# Altium schematic sheet BluePill.SchDoc
size 420 x 297 mm; SheetNumber: 2; SheetTotal: 2
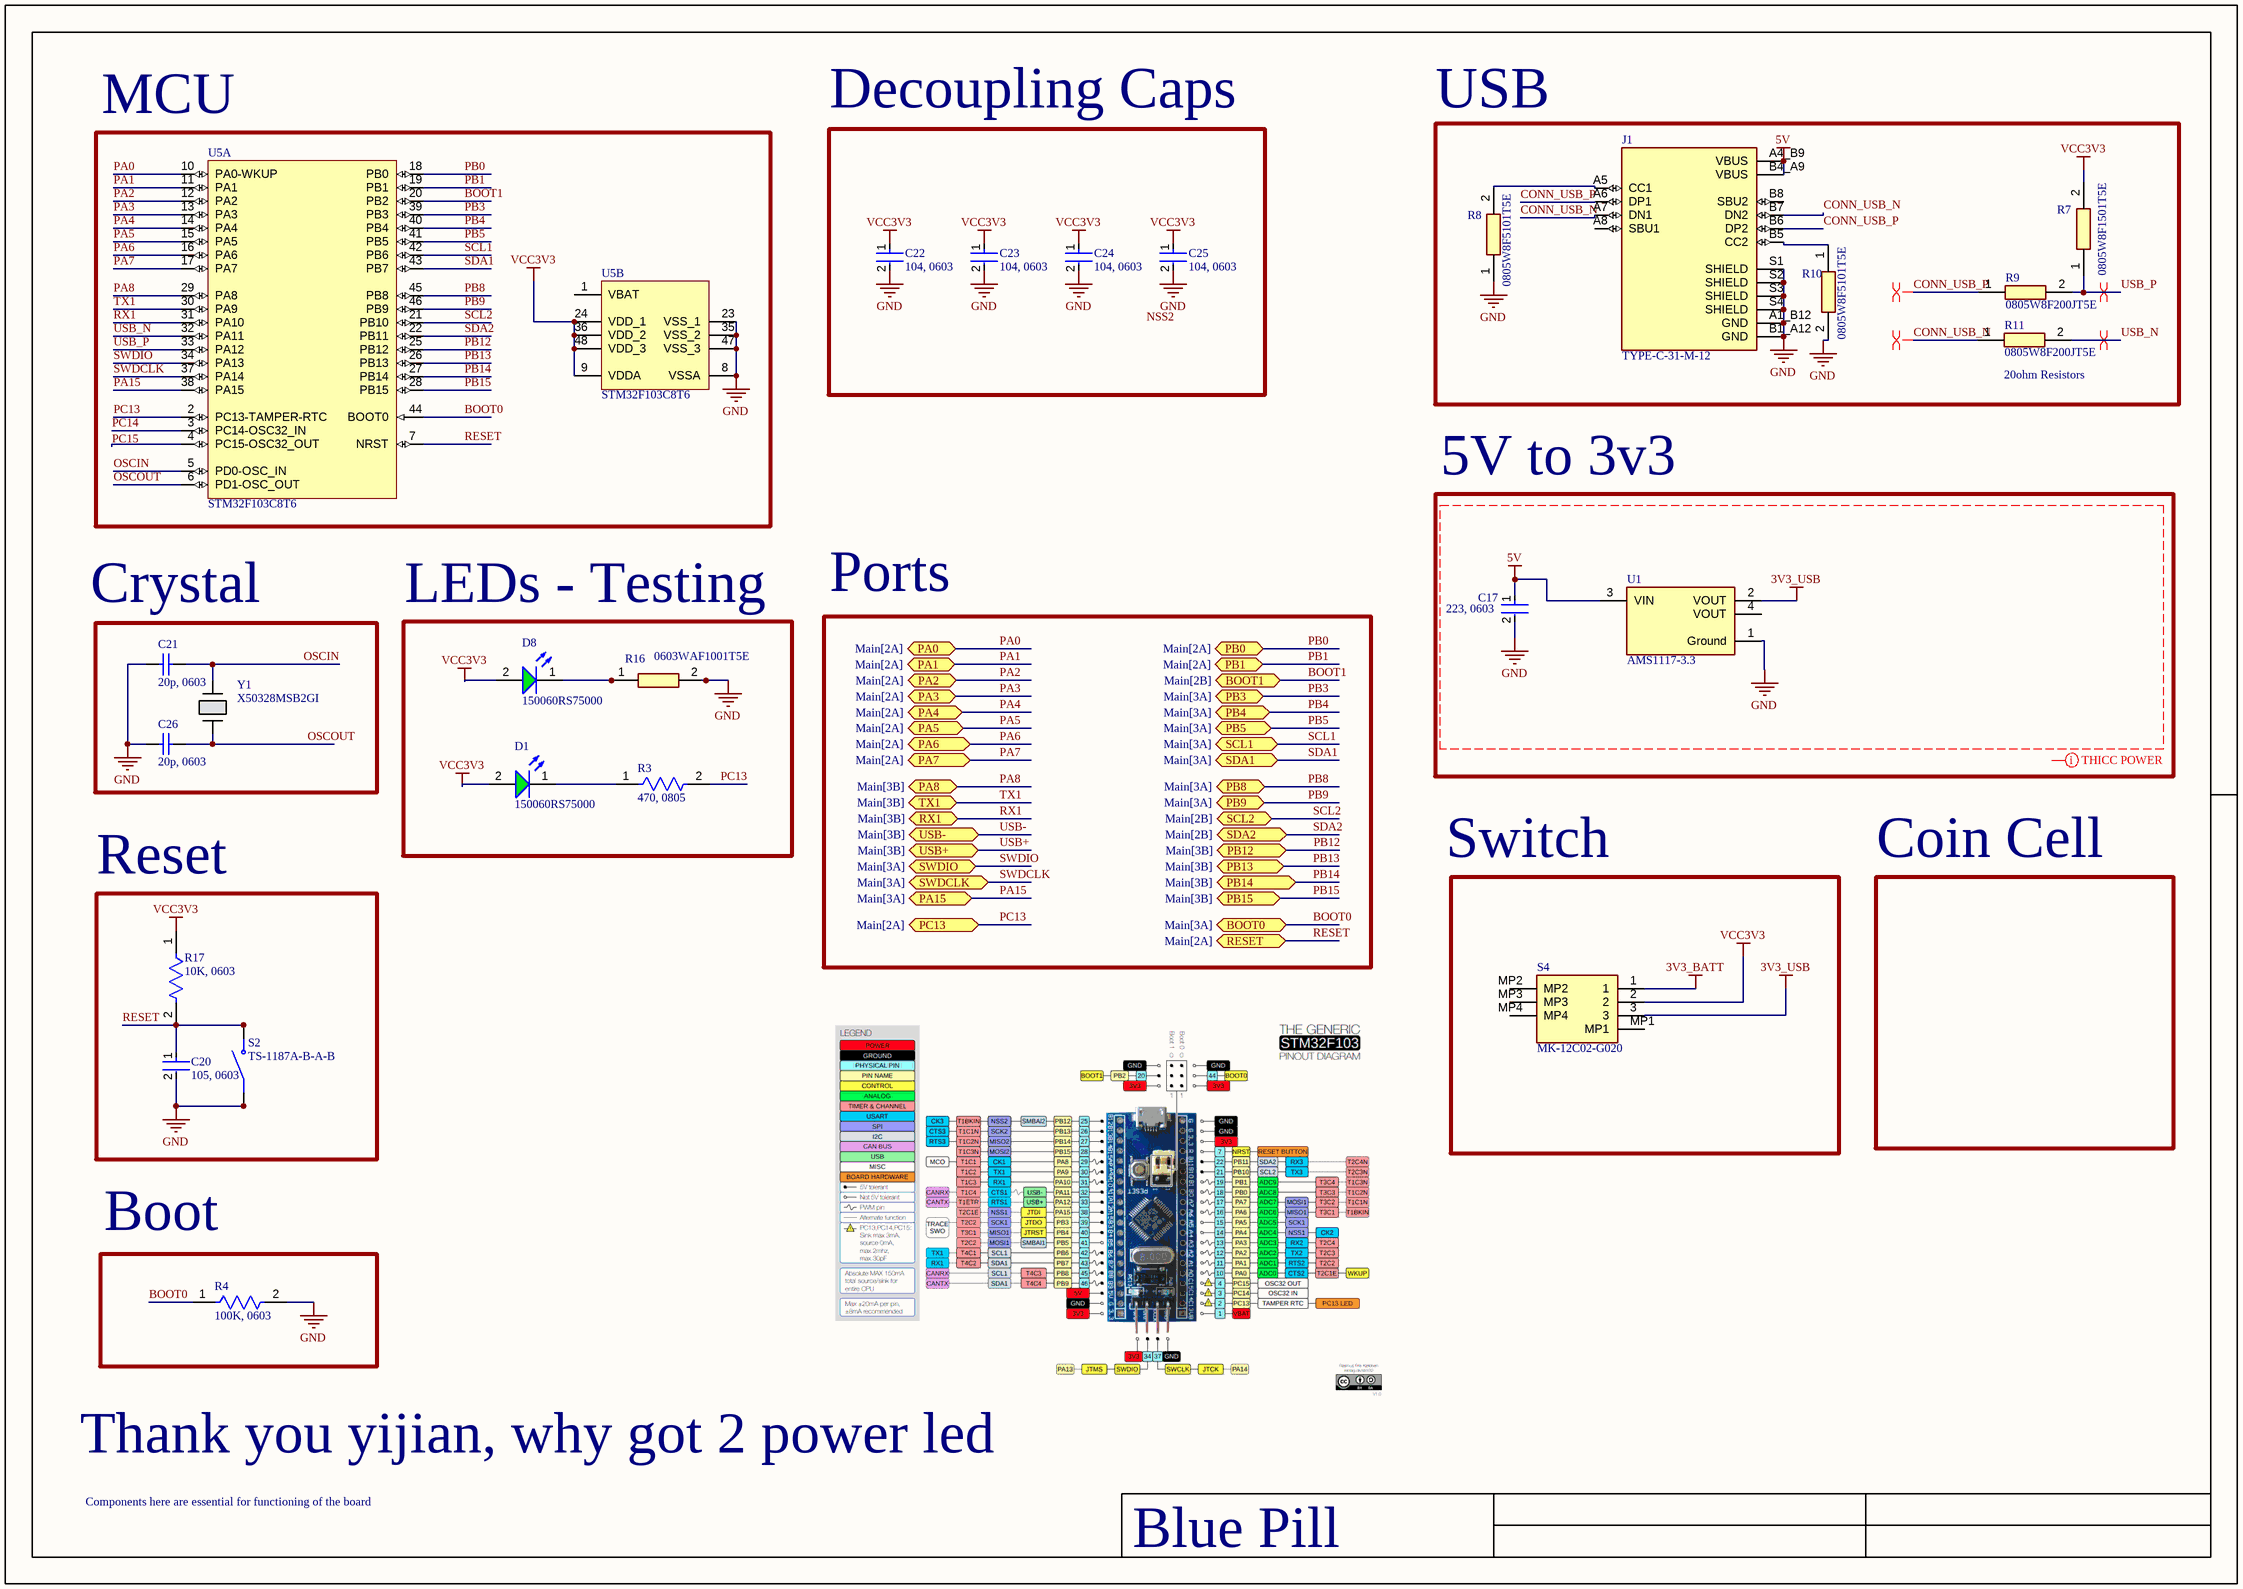
[diagram p0: BluePill.SchDoc]

## Parts
C17  223, 0603  [FP-CC0603-DA-MFG]
C20  105, 0603  [FP-CC0603-DA-MFG]
C21  20p, 0603  [CAPC1608X90X30LL10T20]
C22  104, 0603  [FP-CC0603-DA-MFG]
C23  104, 0603  [FP-CC0603-DA-MFG]
C24  104, 0603  [FP-CC0603-DA-MFG]
C25  104, 0603  [FP-CC0603-DA-MFG]
C26  20p, 0603  [CAPC1608X90X30LL10T20]
D1  150060RS75000  [WL-SMCW_0805_150080xx75000]
D8  150060RS75000  [WL-SMCW_0805_150080xx75000]
J1  TYPE-C-31-M-12  [HRO_TYPE-C-31-M-12]
R3  470, 0805  [FP-RT0805-MFG]
R4  100K, 0603  [FP-RT0603-MFG]
R7  0805W8F1501T5E  [RESC2013X65N]
R8  0805W8F5101T5E  [RESC2013X65N]
R9  0805W8F200JT5E  [RESC2013X65N]
R10  0805W8F5101T5E  [RESC2013X65N]
R11  0805W8F200JT5E  [RESC2013X65N]
R16  0603WAF1001T5E  [RESC1608X55N]
R17  10K, 0603  [FP-RC0603-0_55-IPC_C]
S2  TS-1187A-B-A-B  [SW_TS-1187A-B-A-B]
S4  MK-12C02-G020  [MK12C02G020]
U1  AMS1117-3.3  [FP-AMS1117-IPC_B]
U5  STM32F103C8T6  [STM-LQFP48_L]  (parts A,B of 2)
Y1  X50328MSB2GI  [XTAL_MSB2GI_YXC]

## Blocks framed on the sheet
MCU: U5
Decoupling Caps: C22-C25
USB: J1 R7-R11
5V to 3v3: C17 U1
LEDs - Testing: D1 D8 R3 R16
Reset: C20 R17 S2
Boot: R4

## Ports
BOOT0 (bidir, see Main[3A]), BOOT1 (bidir, see Main[2B]), PA0 (bidir, see Main[2A]), PA1 (bidir, see Main[2A]), PA2 (bidir, see Main[2A]), PA3 (bidir, see Main[2A]), PA4 (bidir, see Main[2A]), PA5 (bidir, see Main[2A]), PA6 (bidir, see Main[2A]), PA7 (bidir, see Main[2A]), PA8 (bidir, see Main[3B]), PA15 (bidir, see Main[3A]), PB0 (bidir, see Main[2A]), PB1 (bidir, see Main[2A]), PB3 (bidir, see Main[3A]), PB4 (bidir, see Main[3A]), PB5 (bidir, see Main[3A]), PB8 (bidir, see Main[3A]), PB9 (bidir, see Main[3A]), PB12 (bidir, see Main[3B]), PB13 (bidir, see Main[3B]), PB14 (bidir, see Main[3B]), PB15 (bidir, see Main[3B]), PC13 (bidir, see Main[2A]), RESET (bidir, see Main[2A]), RX1 (bidir, see Main[3B]), SCL1 (bidir, see Main[3A]), SCL2 (bidir, see Main[2B]), SDA1 (bidir, see Main[3A]), SDA2 (bidir, see Main[2B]), SWDCLK (bidir, see Main[3A]), SWDIO (bidir, see Main[3A]), TX1 (bidir, see Main[3B]), USB+ (bidir, see Main[3B]), USB- (bidir, see Main[3B])

## Nets
3V3_BATT: S4.1
3V3_USB: S4.3 U1.2(VOUT)
5V: C17.1 J1.A4_B9(VBUS) J1.B4_A9(VBUS) U1.3(VIN)
GND: C17.2 C20.2 C21.1 C22.2 C23.2 C24.2 C25.2 C26.1 J1.A1_B12(GND) J1.B1_A12(GND) J1.S1(SHIELD) J1.S2(SHIELD) J1.S3(SHIELD) J1.S4(SHIELD) R4.2 R8.1 R10.2 R16.2 S2.A(COM) S2.B(COM) U1.1(Ground) U5.8(VSSA) U5.23(VSS_1) U5.35(VSS_2) U5.47(VSS_3)
VCC3V3: C22.1 C23.1 C24.1 C25.1 D1.2(A) D8.2(A) R7.2 R17.1 S4.2 U5.9(VDDA) U5.24(VDD_1) U5.36(VDD_2) U5.48(VDD_3)
BOOT0: R4.1 U5.44(BOOT0) ; port BOOT0
BOOT1: U5.20(PB2) ; port BOOT1
CONN_USB_N: J1.A7(DN1) J1.B7(DN2) R11.1
CONN_USB_P: J1.A6(DP1) J1.B6(DP2) R9.1
OSCIN: C21.2 U5.5(PD0-OSC_IN) Y1.1
OSCOUT: C26.2 U5.6(PD1-OSC_OUT) Y1.2
PA0: U5.10(PA0-WKUP) ; port PA0
PA1: U5.11(PA1) ; port PA1
PA2: U5.12(PA2) ; port PA2
PA3: U5.13(PA3) ; port PA3
PA4: U5.14(PA4) ; port PA4
PA5: U5.15(PA5) ; port PA5
PA6: U5.16(PA6) ; port PA6
PA7: U5.17(PA7) ; port PA7
PA8: U5.29(PA8) ; port PA8
PA15: U5.38(PA15) ; port PA15
PB0: U5.18(PB0) ; port PB0
PB1: U5.19(PB1) ; port PB1
PB3: U5.39(PB3) ; port PB3
PB4: U5.40(PB4) ; port PB4
PB5: U5.41(PB5) ; port PB5
PB8: U5.45(PB8) ; port PB8
PB9: U5.46(PB9) ; port PB9
PB12: U5.25(PB12) ; port PB12
PB13: U5.26(PB13) ; port PB13
PB14: U5.27(PB14) ; port PB14
PB15: U5.28(PB15) ; port PB15
PC13: R3.2 U5.2(PC13-TAMPER-RTC) ; port PC13
PC14: U5.3(PC14-OSC32_IN)
PC15: U5.4(PC15-OSC32_OUT)
RESET: C20.1 R17.2 S2.C(NO) S2.D(NO) U5.7(NRST) ; port RESET
RX1: U5.31(PA10) ; port RX1
SCL1: U5.42(PB6) ; port SCL1
SCL2: U5.21(PB10) ; port SCL2
SDA1: U5.43(PB7) ; port SDA1
SDA2: U5.22(PB11) ; port SDA2
SWDCLK: U5.37(PA14) ; port SWDCLK
SWDIO: U5.34(PA13) ; port SWDIO
TX1: U5.30(PA9) ; port TX1
USB+: port USB+
USB-: port USB-
USB_N: R11.2 U5.32(PA11)
USB_P: R7.1 R9.2 U5.33(PA12)
NetD1_1: D1.1(K) R3.1
NetD8_1: D8.1(K) R16.1
NetJ1_A5: J1.A5(CC1) R8.2
NetJ1_B5: J1.B5(CC2) R10.1

Not connected (* = marked no-connect by the designer): J1 A8(SBU1) B8(SBU2); S4 MP1 MP2 MP3 MP4; U1 4(VOUT); U5 1(VBAT)

## Layout directives
CompClassName: THICC POWER CLASS: (no net found under the mark)
differential pair: CONN_USB_N, CONN_USB_P, USB_N, USB_P

## Notes on the sheet
- (near R11) 20ohm Resistors
- Crystal
- Ports
- Switch
- Coin Cell
- Thank you yijian, why got 2 power led
- Components here are essential for functioning of the board
- Blue Pill
- Labels drawn without touching a wire or pin: NSS2

## Library data of the parts
C17 = CMP-2100-03602-3: CAP CER 0.022UF 50V X7R 0603; Dielectric Material: Ceramic; Insulation Resistance: 100GR; Tolerance: 10%; Capacitance: 22nF; Thickness: 0.035inch; Case/Package: 0603; Packaging: Tape and Reel; Voltage Rating (DC): 50V; Length: 1.6mm; Depth: 0.8mm; Dielectric: X7R; Resistor Type: Ceramic; Min Operating Temperature: -55°C; Number of Pins: 2; Series: CC; Mount: Surface Mount; Max Operating Temperature: 125°C; Case Code (Imperial): 0603; Width: 0.031inch; Halogen Free: Halogen Free; Lead Free: Lead Free; Voltage: 50V; RoHS Compliant: Yes; Package Quantity: 1; Height: 0.8mm; REACH SVHC: No SVHC; Voltage Rating: 50V; Case Code (Metric): 1608; Termination: SMD/SMT; Radiation Hardening: No
C20 = CMP-1035-02737-2: CAP CER 1UF 16V X5R 0603; Manufacturer Part Number: CC0603KRX5R7BB105; Manufacturer: YAGEO; Material: Ceramic; Temperature Coefficient: 15%; Tolerance: 0.1; Digikey Description: CAP CER 1UF 16V X5R 0603; Category: Cap; Automotive: No; Octopart: https://octopart.com/cc0603krx5r7bb105-yageo-8376530; Voltage Rating: 16 V; Device Class L3: Ceramic Capacitors; Value: 1 uF; Temperature Characteristic: X5R; Voltage: 16 V; RoHS: TRUE; Lead Free: Yes; Temperature: -55°C to +125°C; Device Class L2: Capacitors; ComponentLink2URL: http://www.yageo.com/documents/recent/UPY-GPHC_X7R_6.3V-to-50V_18.pdf; Capacitance: 1 uF; Footprint Url: http://www.yageo.com/exep/pages/download/literatures/UPY-C_GEN_24.pdf; Height: 0.9mm; ComponentLink2Description: Datasheet; Temperature Range High: +125°C; Mouser Description: Multilayer Ceramic Capacitors MLCC - SMD/SMT 1.0uF 16V X5R 10%; Package: CC0603-DA; Device Class L1: Passive Components; Temperature Range Low: -55°C
C21 C26 = CMP-2000-06100-1: Chip Capacitor, 20 pF, +/- 5%, 50 V, -55 to 85 degC, 0603 (1608 Metric), RoHS, Tape and Reel; Manufacturer: Samsung Electro-Mechanics; Dielectric: C0G; Rated Voltage: 50V; Capacitance: 20pF; Tolerance (%): ±5%; Case Size/Dimension: 0603; Datasheet Version: 06/2016; Manufacturer URL: http://www.samsungsem.com/global/index.jsp; Datasheet URL: http://www.samsungsem.com/kr/support/product-search/mlcc/__icsFiles/afieldfile/2016/08/18/S_CL10C200JB8NNNC.pdf; Mounting Technology: SurfaceMount; Package Description: 2-Pin Surface Mount Device, Body 1.60 x 0.80 mm; Package Reference: 0603
C22-C25 = CMP-2000-05002-2: CAP CER 0.1UF 16V X7R 0603; Manufacturer Part Number: CC0603KRX7R7BB104; Manufacturer: YAGEO; Tolerance: 0.1; Value: 100 nF; Temperature Coefficient: 15%; Material: Ceramic; Voltage Rating: 16 V; Package: CC0603-DA; ComponentLink2Description: Datasheet; Octopart: https://octopart.com/cc0603krx7r7bb104-yageo-192941; Temperature Range High: +125°C; Digikey Description: CAP CER 0.1UF 16V X7R 0603; Voltage: 16 V; Device Class L2: Capacitors; Height: 0.9mm; Temperature: -55°C to +125°C; Device Class L1: Passive Components; Device Class L3: Ceramic Capacitors; ComponentLink2URL: http://www.yageo.com/documents/recent/UPY-GPHC_X7R_6.3V-to-50V_18.pdf; Footprint Url: http://www.yageo.com/exep/pages/download/literatures/UPY-C_GEN_24.pdf; RoHS: TRUE; Temperature Range Low: -55°C; Temperature Characteristic: X7R; Lead Free: Yes; Capacitance: 100 nF; Category: Cap; Mouser Description: Multilayer Ceramic Capacitor, CC Series, 0.1 - F, - 10%, X7R, 16 V, 0603 [1608 Metric]; Automotive: No
D1 D8 = CMP-1426-00007-2: NexarPartId: 29717780; Wavelength: 520nm; Forward Current: 100mA; Lens Style: Clear, Rectangular; Dominant Wavelength: 525nm; Max Junction Temperature (Tj): 95°C; Power Dissipation: 105mW; Luminous Intensity: 450mcd; Peak Wavelength: 515nm; Color: Green; Viewing Angle: 140°; Test Current: 20mA; Reverse Voltage: 5V; Forward Voltage: 3.2V; Mount: Surface Mount; REACH SVHC: Unknown; Min Operating Temperature: -40°C; Case Code (Imperial): 0805; Case/Package: 0805; Max Operating Temperature: 85°C; RoHS: Compliant; Length: 2mm; Height: 700µm; Width: 1.25mm; Case Code (Metric): 2012; Packaging: Tape and Reel; Max Reverse Voltage (DC): 5V
J1 = CMP-002-00071-1: USB Connectors 24 Receptacle 1 8.94*7.3mm RoHS; MF: HRO Electronics Co., Ltd.; Value: *; Price: None; Component Type: Standard; Check_prices: https://www.snapeda.com/parts/TYPE-C-31-M-12/HRO+Electronics+Co.%252C+Ltd./view-part/?ref=eda; MP: TYPE-C-31-M-12; Case/Package: Package; Availability: Not in stock; Design Item ID: TYPE-C-31-M-12; Source: TYPE-C-31-M-12.SchLib; SnapEDA_Link: https://www.snapeda.com/parts/TYPE-C-31-M-12/HRO+Electronics+Co.%252C+Ltd./view-part/?ref=snap; Pins: 16
R3 = CMP-03412-031818-1: RES SMD 470 OHM 1% 1/8W 0805; Manufacturer Part Number: RT0805FRE07470RL; Manufacturer: Yageo; Temperature Coefficient: 50 ppm/°C; Value: 470Ω; Tolerance: 0.0001; Voltage Rating: 150V; Power Rating: 0.125W; Automotive: No; Device Class L2: Resistors; Lead Free: Yes; Digikey Description: RES SMD 470 OHM 1% 1/8W 0805; Category: Res; Package: RT0805; ComponentLink2Description: Datasheet; Ipc Land Pattern Name: RESC200125X50; Resistance: 470Ω; Octopart: https://octopart.com/rt0805fre07470rl-yageo-39983328; Height: 0.6mm; Temperature Range High: +155°C; Composition: Thin Film; Footprint Url: http://www.yageo.com/exep/pages/download/literatures/PYu-R_Mount_10.pdf; Device Class L1: Passive Components; Temperature Range Low: -55°C; Temperature: -55°C to +155°C; RoHS: TRUE; ComponentLink2URL: http://www.yageo.com/documents/recent/PYu-RT_1-to-0.01_RoHS_L_9.pdf; Mouser Description: High Precision-High Stability Chip Resistor Thin Film 0805 470Ohm 1% Paper T/R; Device Class L3: Chip SMD Resistors; Series: RT
R4 = CMP-03412-015060-1: RES SMD 100K OHM 1% 1/10W 0603; Manufacturer: Yageo; Manufacturer Part Number: RT0603FRE07100KL; Tolerance: 0.01; Resistance: 100KΩ; Temperature Coefficient: 50 ppm/°C; Value: 100KΩ; Power Rating: 0.1W; Voltage Rating: 75V; Temperature: -55°C to +155°C; Height: 0.55mm; Octopart: https://octopart.com/rt0603fre07100kl-yageo-41455806; Ipc Land Pattern Name: RESC16080X45; Lead Free: Yes; Device Class L1: Passive Components; Temperature Range Low: -55°C; Temperature Range High: +155°C; Category: Res; Composition: Thin Film; Device Class L3: Chip SMD Resistors; Digikey Description: RES SMD 100K OHM 1% 1/10W 0603; Package: RT0603; Automotive: No; Mouser Description: High Precision-High Stability Chip Resistor Thin Film 0603 100kOhm 1% Paper T/R; Footprint Url: http://www.yageo.com/exep/pages/download/literatures/PYu-R_Mount_10.pdf; ComponentLink2Description: Datasheet; Series: RT; ComponentLink2URL: http://www.yageo.com/documents/recent/PYu-RT_1-to-0.01_RoHS_L_9.pdf; Device Class L2: Resistors; RoHS: TRUE
R7 R9 R11 = 0805W8F200JT5E: Resistor; Manufacturer_Name: UNI-ROYAL(Uniroyal Elec); Height: 0.65mm
  R7: Manufacturer_Part_Number: 0805W8F1501T5E
  R9 R11: Datasheet Link: https://datasheet.lcsc.com/lcsc/2206010200_UNI-ROYAL-Uniroyal-Elec-0805W8F200JT5E_C17544.pdf; Manufacturer_Part_Number: 0805W8F200JT5E
R8 R10 = 0805W8F5101T5E: Resistor; Manufacturer_Name: UNI-ROYAL(Uniroyal Elec); Datasheet Link: https://datasheet.lcsc.com/lcsc/2206010030_UNI-ROYAL-Uniroyal-Elec-0805W8F5101T5E_C27834.pdf; Height: 0.65mm; Manufacturer_Part_Number: 0805W8F5101T5E
R16 = CMP-062-000000-1: 1k +/-1% 0.1W +/-100ppm/ 0603 Chip Resistor - Surface Mount; Manufacturer_Name: UNI-ROYAL(Uniroyal Elec); Height: 0.55mm; Manufacturer_Part_Number: 0603WAF1001T5E; Datasheet Link: https://datasheet.lcsc.com/szlcsc/Uniroyal-Elec-0603WAF1001T5E_C21190.pdf; Design Item ID: 0603WAF1001T5E; Source: SamacSys.SchLib
R17 = CMP-2100-03664-2: RES 10K OHM 1% 1/10W 0603; Voltage Rating: 75V; Voltage Rating (DC): 50V; Resistance: 10kR; Power Rating: 100mW; Temperature Coefficient: 100ppm/°C; Depth: 0.8mm; Termination: SMD/SMT; Resistor Type: Thick Film; Series: RC; Construction: Rectangular; Features: Moisture Resistant; Packaging: Tape and Reel; Min Operating Temperature: -55°C; Number of Terminations: 2; Lead Pitch: 0.3mm; RoHS Compliant: Yes; Case/Package: 0603; Resistance Tolerance: 1%; Military Standard: Not; Weight: 7.1E-05oz; Number of Pins: 2; Tolerance: 1%; Length: 1.6mm; Case Code (Imperial): 0603; Lead Free: Lead Free; Width: 0.8mm; Max Power Dissipation: 100mW; Height: 0.45mm; Max Operating Temperature: 155°C; Case Code (Metric): 1608; Size Code: 0603
S2 = CMP-033-000000-1: SPST 50mA @ 12VDC Top Actuated Round Button 160gf SMD Tactile Switches RoHS; MP: TS-1187A-B-A-B; Value: *; Design Item ID: TS-1187A-B-A-B; Availability: Unavailable; Package: None; Price: None; Component Type: Standard; Pin Count: 4; Source: TS-1187A-B-A-B.SchLib
S4 = MK-12C02-G020: Switch; Manufacturer_Name: G-Switch Electronic; Datasheet Link: https://datasheet.lcsc.com/lcsc/2012062037_G-Switch-MK-12C02-G020_C963206.pdf; Height: 1.45mm; Manufacturer_Part_Number: MK-12C02-G020
U1 = CMP-019-00049-1: Fixed Positive LDO Regulator, 3.3V, 1.3V Dropout, PDSO3; RoHS Compliant: Yes; Case/Package: SOP; Pins: 3
U5 = CMP-0237-00215-3: ARM Cortex-M3 32-bit MCU, 64 KB Flash, 20 KB Internal RAM, 37 I/Os, 48-pin LQFP, -40 to 85 degC, Tray; Supply Voltage(Vcc) min (V): 2; Internal RAM Size (kB): 20; FLASH Size (Prog) (kB): 64; A/D Converter: 2x12-bit (10 Channel); I/Os (High Current): 37; Operating Frequency(F) (Processor speed) (MHz): 72; Core: ARM Cortex-M3; ComponentLink3Description: Package Specification; Mounting Technology: Surface Mount; PartNumber: STM32F103C8T6; PackageReference: LQFP48; Packing: Tray; ComponentLink3URL: http://www.st.com/st-web-ui/static/active/en/resource/technical/document/datasheet/DM00058181.pdf; DatasheetVersion: Rev. 16; ComponentLink1URL: http://www.st.com/web/en/home.html; PackageVersion: Rev. 6, 06/2013; ComponentLink2URL: http://www.st.com/st-web-ui/static/active/en/resource/technical/document/datasheet/CD00161566.pdf; ComponentLink1Description: Manufacturer URL; ComponentLink2Description: Datasheet; PackageDescription: 48-Pin Low Profile Quad Flat Package, 7 x 7 mm Body, 0.5 mm Pitch
Y1 = CMP-069-000002-4: 8MHz 20pF ±10ppm ±50ppm SMD5032-2P Crystals ROHS; Mfr_Name: YXC; Manufacturer_Part_Number: X50328MSB2GI; Copyright: Copyright (C) 2024 Ultra Librarian. All rights reserved.; Type: DEV; Source: X50328MSB2GI.SchLib; Design Item ID: X50328MSB2GI; RefDes: RefDes